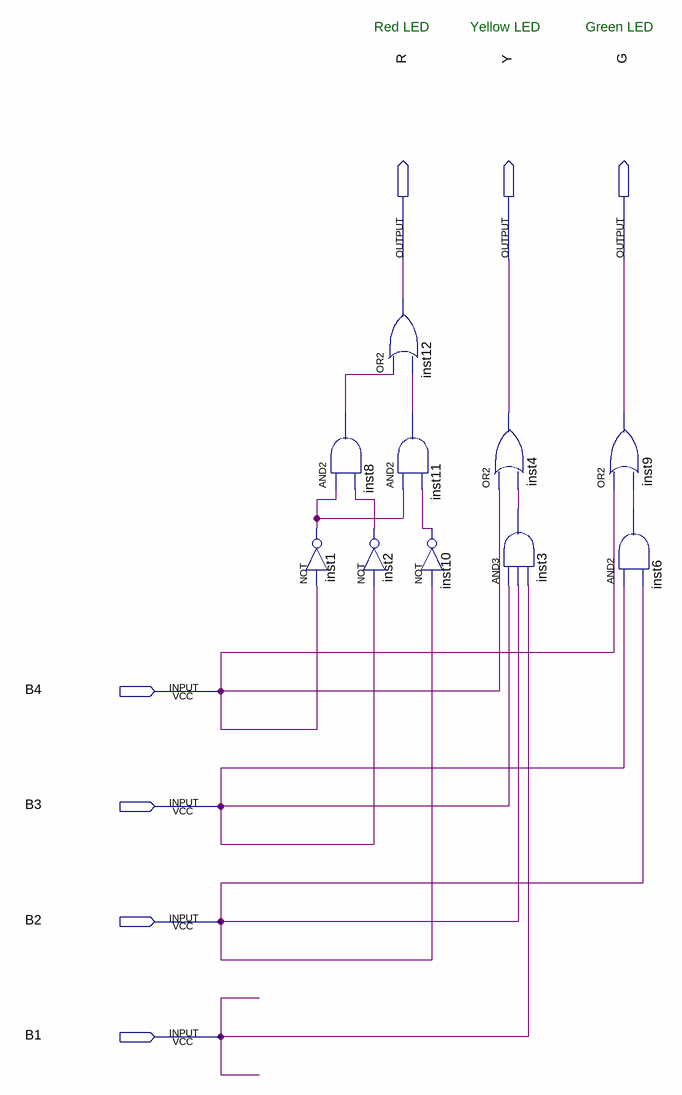
[diagram p0: schematic sheet]
// Quartus schematic Project.bdf as structural Verilog: 10 symbols, 7 pins
module Project (
  input  B4,
  input  B3,
  input  B2,
  input  B1,
  output R,
  output Y,
  output G
);

  wire inst1_out, inst2_out, inst3_out, inst6_out, inst8_out, inst10_out, inst11_out;

  and inst8 (inst8_out, inst1_out, inst2_out);
  not inst1 (inst1_out, B4);
  not inst2 (inst2_out, B3);
  or inst12 (R, inst8_out, inst11_out);
  and inst11 (inst11_out, inst1_out, inst10_out);
  not inst10 (inst10_out, B2);
  or inst4 (Y, B4, inst3_out);
  and inst3 (inst3_out, B3, B2, B1);
  or inst9 (G, B4, inst6_out);
  and inst6 (inst6_out, B3, B2);

  // Notes on the sheet:
  //   Red LED
  //   Yellow LED
  //   Green LED
endmodule
